# EAGLE design led balloon_v28 (EAGLE 6.0)
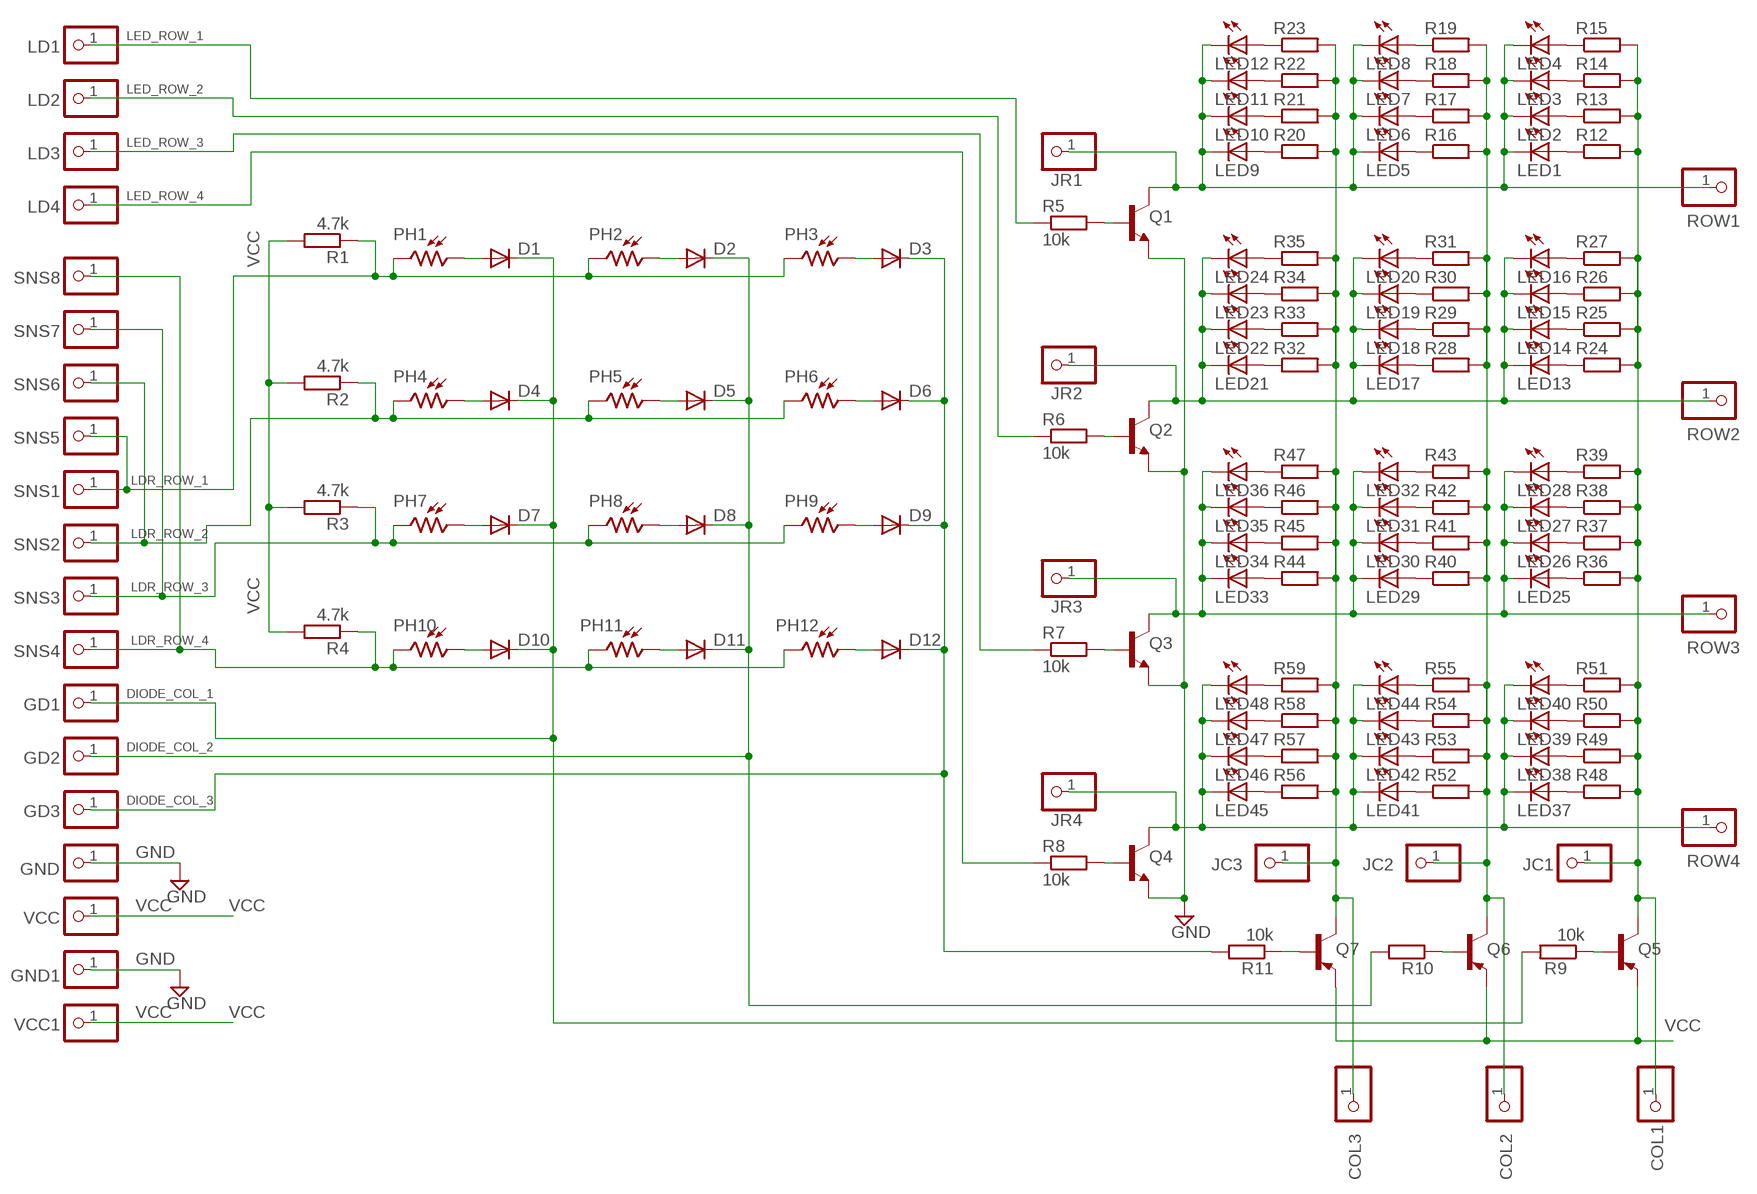
[diagram p0: schematic, sheet 1]

## Parts
COL1  PINHD-1X1  [1X01]
COL2  PINHD-1X1  [1X01]
COL3  PINHD-1X1  [1X01]
D1  1N4148DO35-7  [DO35-7]
D2  1N4148DO35-7  [DO35-7]
D3  1N4148DO35-7  [DO35-7]
D4  1N4148DO35-7  [DO35-7]
D5  1N4148DO35-7  [DO35-7]
D6  1N4148DO35-7  [DO35-7]
D7  1N4148DO35-7  [DO35-7]
D8  1N4148DO35-7  [DO35-7]
D9  1N4148DO35-7  [DO35-7]
D10  1N4148DO35-7  [DO35-7]
D11  1N4148DO35-7  [DO35-7]
D12  1N4148DO35-7  [DO35-7]
GD1  PINHD-1X1  [1X01]
GD2  PINHD-1X1  [1X01]
GD3  PINHD-1X1  [1X01]
GND  PINHD-1X1  [1X01]
GND1  PINHD-1X1  [1X01]
JC1  PINHD-1X1  [1X01]
JC2  PINHD-1X1  [1X01]
JC3  PINHD-1X1  [1X01]
JR1  PINHD-1X1  [1X01]
JR2  PINHD-1X1  [1X01]
JR3  PINHD-1X1  [1X01]
JR4  PINHD-1X1  [1X01]
LD1  PINHD-1X1  [1X01]
LD2  PINHD-1X1  [1X01]
LD3  PINHD-1X1  [1X01]
LD4  PINHD-1X1  [1X01]
LED1  LED3MM  [LED3MM]
LED2  LED3MM  [LED3MM]
LED3  LED3MM  [LED3MM]
LED4  LED3MM  [LED3MM]
LED5  LED3MM  [LED3MM]
LED6  LED3MM  [LED3MM]
LED7  LED3MM  [LED3MM]
LED8  LED3MM  [LED3MM]
LED9  LED3MM  [LED3MM]
LED10  LED3MM  [LED3MM]
LED11  LED3MM  [LED3MM]
LED12  LED3MM  [LED3MM]
LED13  LED3MM  [LED3MM]
LED14  LED3MM  [LED3MM]
LED15  LED3MM  [LED3MM]
LED16  LED3MM  [LED3MM]
LED17  LED3MM  [LED3MM]
LED18  LED3MM  [LED3MM]
LED19  LED3MM  [LED3MM]
LED20  LED3MM  [LED3MM]
LED21  LED3MM  [LED3MM]
LED22  LED3MM  [LED3MM]
LED23  LED3MM  [LED3MM]
LED24  LED3MM  [LED3MM]
LED25  LED3MM  [LED3MM]
LED26  LED3MM  [LED3MM]
LED27  LED3MM  [LED3MM]
LED28  LED3MM  [LED3MM]
LED29  LED3MM  [LED3MM]
LED30  LED3MM  [LED3MM]
LED31  LED3MM  [LED3MM]
LED32  LED3MM  [LED3MM]
LED33  LED3MM  [LED3MM]
LED34  LED3MM  [LED3MM]
LED35  LED3MM  [LED3MM]
LED36  LED3MM  [LED3MM]
LED37  LED3MM  [LED3MM]
LED38  LED3MM  [LED3MM]
LED39  LED3MM  [LED3MM]
LED40  LED3MM  [LED3MM]
LED41  LED3MM  [LED3MM]
LED42  LED3MM  [LED3MM]
LED43  LED3MM  [LED3MM]
LED44  LED3MM  [LED3MM]
LED45  LED3MM  [LED3MM]
LED46  LED3MM  [LED3MM]
LED47  LED3MM  [LED3MM]
LED48  LED3MM  [LED3MM]
PH1  LDR  [VT900]
PH2  VT83N4  [VT800]
PH3  VT83N4  [VT800]
PH4  VT83N4  [VT800]
PH5  VT83N4  [VT800]
PH6  VT83N4  [VT800]
PH7  VT83N4  [VT800]
PH8  VT83N4  [VT800]
PH9  VT83N4  [VT800]
PH10  VT83N4  [VT800]
PH11  VT83N4  [VT800]
PH12  VT83N4  [VT800]
Q1  BC847ASMD  [SOT23]
Q2  BC847ASMD  [SOT23]
Q3  BC847ASMD  [SOT23]
Q4  BC847ASMD  [SOT23]
Q5  BC807-40SMD  [SOT23-BEC]
Q6  BC807-40SMD  [SOT23-BEC]
Q7  BC807-40SMD  [SOT23-BEC]
R1  4.7k  R-EU_0204/5  [0204/5]
R2  4.7k  R-EU_0204/5  [0204/5]
R3  4.7k  R-EU_0204/5  [0204/5]
R4  4.7k  R-EU_0204/5  [0204/5]
R5  10k  R-EU_0204/5  [0204/5]
R6  10k  R-EU_0204/5  [0204/5]
R7  10k  R-EU_0204/5  [0204/5]
R8  10k  R-EU_0204/5  [0204/5]
R9  10k  R-EU_0204/5  [0204/5]
R10  10k  R-EU_0204/5  [0204/5]
R11  10k  R-EU_0204/5  [0204/5]
R12  R-EU_R0805  [R0805]
R13  R-EU_R0805  [R0805]
R14  R-EU_R0805  [R0805]
R15  R-EU_R0805  [R0805]
R16  R-EU_R0805  [R0805]
R17  R-EU_R0805  [R0805]
R18  R-EU_R0805  [R0805]
R19  R-EU_R0805  [R0805]
R20  R-EU_R0805  [R0805]
R21  R-EU_R0805  [R0805]
R22  R-EU_R0805  [R0805]
R23  R-EU_R0805  [R0805]
R24  R-EU_R0805  [R0805]
R25  R-EU_R0805  [R0805]
R26  R-EU_R0805  [R0805]
R27  R-EU_R0805  [R0805]
R28  R-EU_R0805  [R0805]
R29  R-EU_R0805  [R0805]
R30  R-EU_R0805  [R0805]
R31  R-EU_R0805  [R0805]
R32  R-EU_R0805  [R0805]
R33  R-EU_R0805  [R0805]
R34  R-EU_R0805  [R0805]
R35  R-EU_R0805  [R0805]
R36  R-EU_R0805  [R0805]
R37  R-EU_R0805  [R0805]
R38  R-EU_R0805  [R0805]
R39  R-EU_R0805  [R0805]
R40  R-EU_R0805  [R0805]
R41  R-EU_R0805  [R0805]
R42  R-EU_R0805  [R0805]
R43  R-EU_R0805  [R0805]
R44  R-EU_R0805  [R0805]
R45  R-EU_R0805  [R0805]
R46  R-EU_R0805  [R0805]
R47  R-EU_R0805  [R0805]
R48  R-EU_R0805  [R0805]
R49  R-EU_R0805  [R0805]
R50  R-EU_R0805  [R0805]
R51  R-EU_R0805  [R0805]
R52  R-EU_R0805  [R0805]
R53  R-EU_R0805  [R0805]
R54  R-EU_R0805  [R0805]
R55  R-EU_R0805  [R0805]
R56  R-EU_R0805  [R0805]
R57  R-EU_R0805  [R0805]
R58  R-EU_R0805  [R0805]
R59  R-EU_R0805  [R0805]
ROW1  PINHD-1X1  [1X01]
ROW2  PINHD-1X1  [1X01]
ROW3  PINHD-1X1  [1X01]
ROW4  PINHD-1X1  [1X01]
SNS1  PINHD-1X1  [1X01]
SNS2  PINHD-1X1  [1X01]
SNS3  PINHD-1X1  [1X01]
SNS4  PINHD-1X1  [1X01]
SNS5  PINHD-1X1  [1X01]
SNS6  PINHD-1X1  [1X01]
SNS7  PINHD-1X1  [1X01]
SNS8  PINHD-1X1  [1X01]
VCC  PINHD-1X1  [1X01]
VCC1  PINHD-1X1  [1X01]

## Nets
DIODE_COL_1: D1.C D4.C D7.C D10.C GD1.1 R9.2
DIODE_COL_2: D2.C D5.C D8.C D11.C GD2.1 R10.2
DIODE_COL_3: D3.C D6.C D9.C D12.C GD3.1 R11.2
GND [pwr]: GND1.1 GND.1 Q1.2(E) Q2.2(E) Q3.2(E) Q4.2(E)
LDR_ROW_1: PH1.2 PH2.2 PH3.2 R1.1 SNS1.1 SNS5.1
LDR_ROW_2: PH4.2 PH5.2 PH6.2 R2.1 SNS2.1 SNS6.1
LDR_ROW_3: PH7.2 PH8.2 PH9.2 R3.1 SNS3.1 SNS7.1
LDR_ROW_4: PH10.2 PH11.2 PH12.2 R4.1 SNS4.1 SNS8.1
LED_ROW_1: LD1.1 R5.1
LED_ROW_2: LD2.1 R6.1
LED_ROW_3: LD3.1 R7.1
LED_ROW_4: LD4.1 R8.1
N$1: D1.A PH1.1
N$2: D2.A PH2.1
N$3: D3.A PH3.1
N$4: D6.A PH6.1
N$5: D5.A PH5.1
N$6: D4.A PH4.1
N$7: D7.A PH7.1
N$8: D8.A PH8.1
N$9: D9.A PH9.1
N$10: D12.A PH12.1
N$11: D11.A PH11.1
N$12: D10.A PH10.1
N$13: Q6.B R10.1
N$14: Q7.B R11.1
N$15: Q5.B R9.1
N$16: JR1.1 LED1.K(C) LED2.K(C) LED3.K(C) LED4.K(C) LED5.K(C) LED6.K(C) LED7.K(C) LED8.K(C) LED9.K(C) LED10.K(C) LED11.K(C) LED12.K(C) Q1.3(C) ROW1.1
N$17: LED1.A R12.1
N$18: LED2.A R13.1
N$19: LED3.A R14.1
N$20: LED4.A R15.1
N$21: Q1.1(B) R5.2
N$22: JR3.1 LED25.K(C) LED26.K(C) LED27.K(C) LED28.K(C) LED29.K(C) LED30.K(C) LED31.K(C) LED32.K(C) LED33.K(C) LED34.K(C) LED35.K(C) LED36.K(C) Q3.3(C) ROW3.1
N$24: LED9.A R20.1
N$25: LED10.A R21.1
N$26: LED11.A R22.1
N$27: COL2.1 JC2.1 Q6.C R16.2 R17.2 R18.2 R19.2 R28.2 R29.2 R30.2 R31.2 R40.2 R41.2 R42.2 R43.2 R52.2 R53.2 R54.2 R55.2
N$28: LED13.A R24.1
N$29: Q2.1(B) R6.2
N$30: LED5.A R16.1
N$31: LED6.A R17.1
N$32: LED7.A R18.1
N$33: LED8.A R19.1
N$34: LED14.A R25.1
N$35: Q3.1(B) R7.2
N$37: LED12.A R23.1
N$38: LED15.A R26.1
N$39: LED16.A R27.1
N$41: LED17.A R28.1
N$42: Q4.1(B) R8.2
N$43: LED18.A R29.1
N$44: LED19.A R30.1
N$45: LED20.A R31.1
N$47: COL1.1 JC1.1 Q5.C R12.2 R13.2 R14.2 R15.2 R24.2 R25.2 R26.2 R27.2 R36.2 R37.2 R38.2 R39.2 R48.2 R49.2 R50.2 R51.2
N$48: LED21.A R32.1
N$49: LED22.A R33.1
N$50: LED23.A R34.1
N$51: LED24.A R35.1
N$52: COL3.1 JC3.1 Q7.C R20.2 R21.2 R22.2 R23.2 R32.2 R33.2 R34.2 R35.2 R44.2 R45.2 R46.2 R47.2 R56.2 R57.2 R58.2 R59.2
N$53: LED25.A R36.1
N$54: LED26.A R37.1
N$55: LED27.A R38.1
N$56: LED28.A R39.1
N$58: LED29.A R40.1
N$59: LED30.A R41.1
N$60: LED31.A R42.1
N$61: LED32.A R43.1
N$64: LED33.A R44.1
N$65: LED34.A R45.1
N$66: LED35.A R46.1
N$67: LED36.A R47.1
N$69: LED37.A R48.1
N$70: LED38.A R49.1
N$71: LED39.A R50.1
N$72: LED40.A R51.1
N$74: LED41.A R52.1
N$75: LED42.A R53.1
N$76: LED43.A R54.1
N$77: LED44.A R55.1
N$79: JR2.1 LED13.K(C) LED14.K(C) LED15.K(C) LED16.K(C) LED17.K(C) LED18.K(C) LED19.K(C) LED20.K(C) LED21.K(C) LED22.K(C) LED23.K(C) LED24.K(C) Q2.3(C) ROW2.1
N$80: LED45.A R56.1
N$81: LED46.A R57.1
N$82: LED47.A R58.1
N$83: LED48.A R59.1
N$93: JR4.1 LED37.K(C) LED38.K(C) LED39.K(C) LED40.K(C) LED41.K(C) LED42.K(C) LED43.K(C) LED44.K(C) LED45.K(C) LED46.K(C) LED47.K(C) LED48.K(C) Q4.3(C) ROW4.1
VCC [pwr]: Q5.E Q6.E Q7.E R1.2 R2.2 R3.2 R4.2 VCC1.1 VCC.1

## Library data of the parts
COL1-COL3 GD1-GD3 GND GND1 JC1-JC3 JR1-JR4 LD1-LD4 ROW1-ROW4 SNS1-SNS8 VCC VCC1 = pinhead:PINHD-1X1: PIN HEADER
D1-D12 = diode:1N4148: DIODE high speed (Philips)
LED1-LED48 = CEDTv66:LED
PH1 = ldr_3_5:LDR
PH2-PH12 = ldr_3_5:VT8: Photoconductive Cell VT800 Series Source: http://optoelectronics.perkinelmer.com/content/Datasheets/DTS_vt800seriesdatasheet.pdf
Q1-Q4 = transistor-npn:BC847*: NPN Transistor
Q5-Q7 = transistor-pnp:BC807*: PNP Transistror
R1-R11 = resistor:R-EU_: RESISTOR, European symbol
R12-R59 = rcl:R-EU_: RESISTOR, European symbol

## Net classes
0 default: width 0.406 mm
1 pwr: width 0.508 mm

## Board
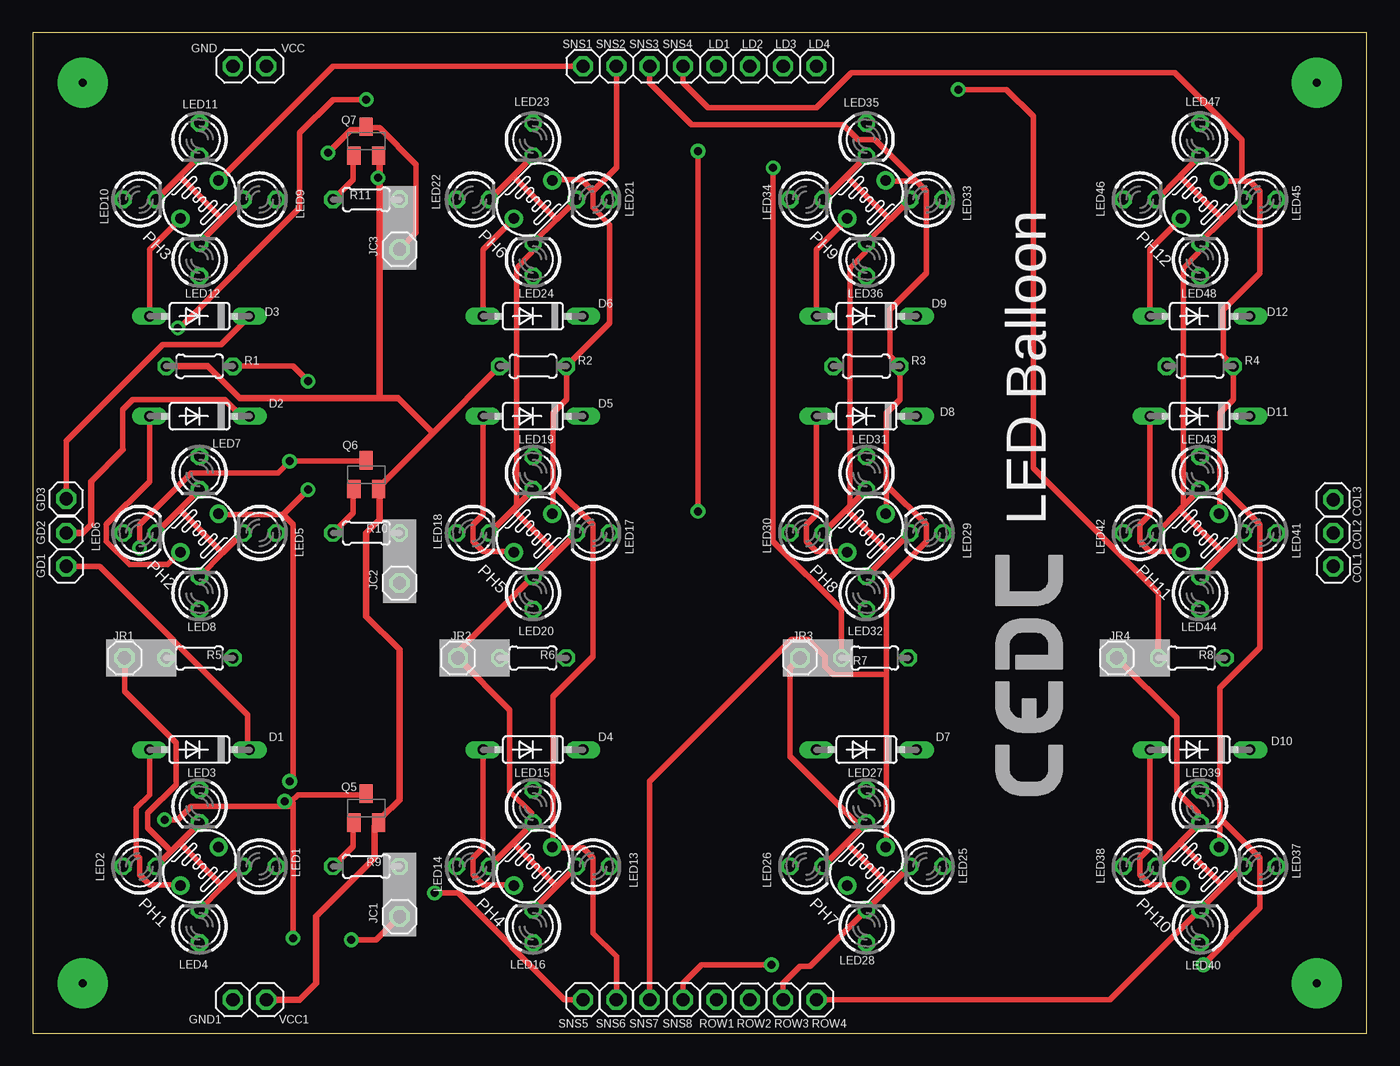
[diagram p1: board, top side]
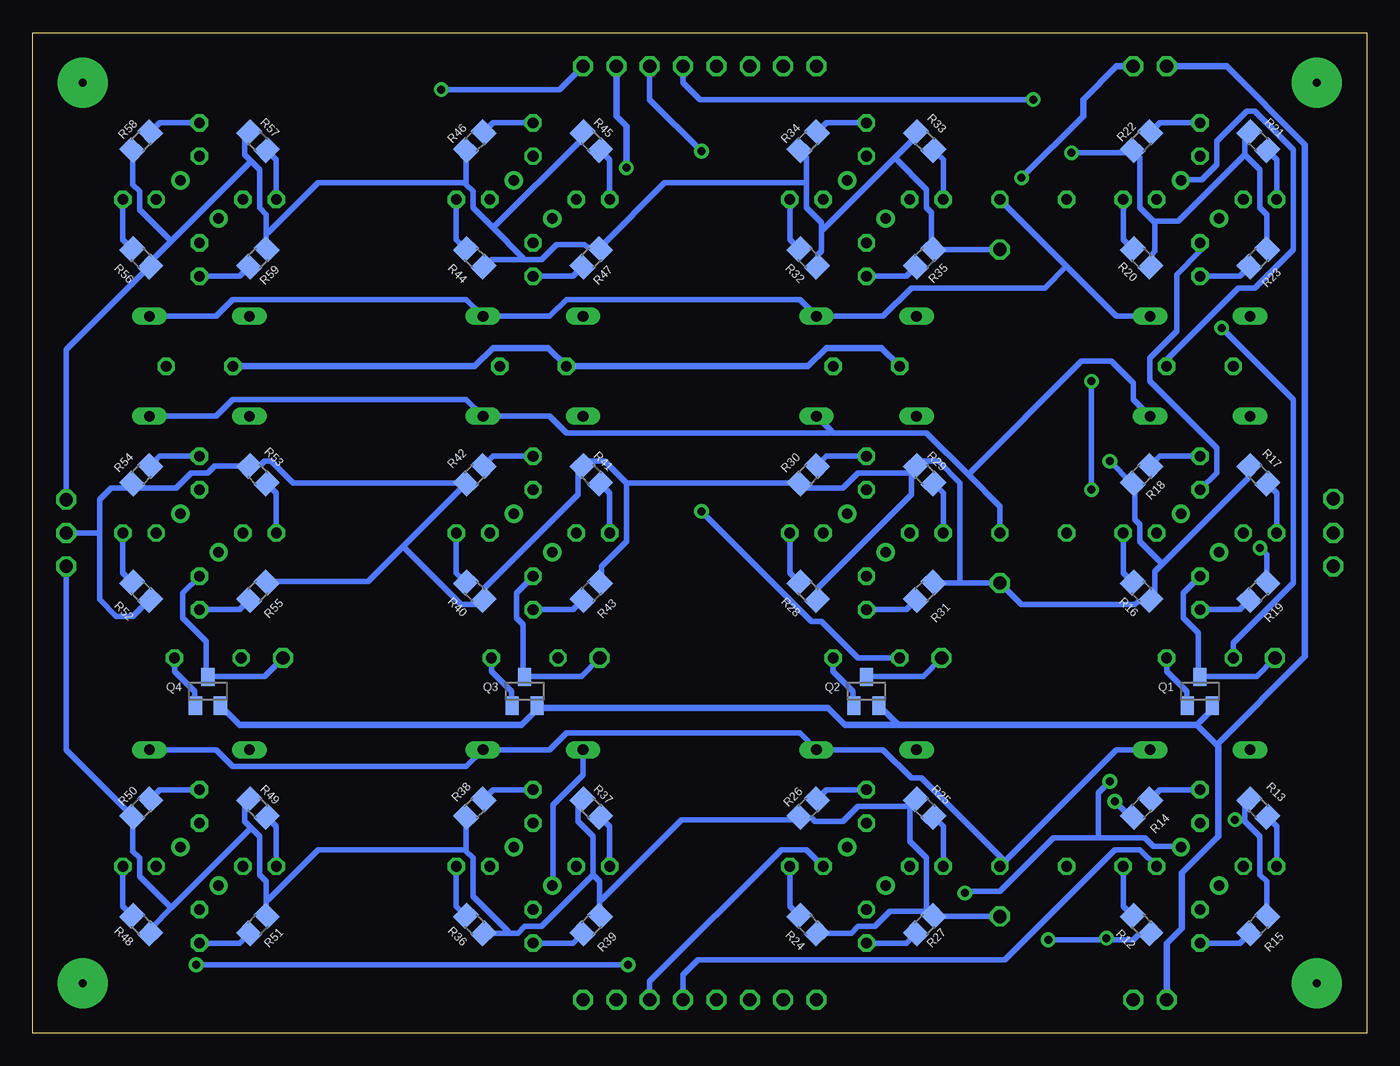
[diagram p2: board, bottom side, seen from below]

Size 101.6 x 76.2 mm. Coordinates in mm from the lower left corner, seen from the top.
Outline: 0,0 101.6,0 101.6,76.2 0,76.2 0,0
Copper layers (1*16): Top 0.035mm / dielectric 1.5mm / Bottom 0.035mm
Design rules "default": minimum track width 16mil, minimum drill 24mil, track to track 16mil, track to pad 16mil, pad to pad 16mil, via to via 16mil, smd to smd 16mil, copper to edge 40mil, drill to drill 10mil, minimum pad ring 10mil, minimum via ring 10mil, stop-mask expansion 4mil, vias tented up to drill 0mil, thermal gap 10mil

### Footprints (pad centres in the part's own frame; a part is rotated, then mirrored left to right if it is on the bottom)
1X01 = drill 1.016 octagon: 1 0,0
DO35-7 = drill 0.813 long: A 3.81,0; C -3.81,0
LED3MM = drill 0.813 octagon: A -1.27,0; K 1.27,0
VT900 = drill 0.8 pad 1.4: 1 -2.057,0; 2 2.057,0
SOT23 = smd 1 x 1.4: 1 -0.95,-1.1; 2 0.95,-1.1; 3 0,1.1
SOT23-BEC = smd 1 x 1.4: B -0.95,-1.1; C 0,1.1; E 0.95,-1.1
0204/5 = drill 0.813 octagon: 1 -2.54,0; 2 2.54,0
R0805 = smd 1.3 x 1.5: 1 -0.95,0; 2 0.95,0

### Placement (x,y rotation side)
COL1  99.06,35.56 0 top
COL2  99.06,38.1 180 top
COL3  99.06,40.64 180 top
D1  12.7,21.59 180 top
D2  12.7,46.99 180 top
D3  12.7,54.61 180 top
D4  38.1,21.59 180 top
D5  38.1,46.99 180 top
D6  38.1,54.61 180 top
D7  63.5,21.59 180 top
D8  63.5,46.99 180 top
D9  63.5,54.61 180 top
D10  88.9,21.59 180 top
D11  88.9,46.99 180 top
D12  88.9,54.61 180 top
E$1  [LOGO-CEDT-SILK-18MM]  78.42,18.1 90 top
GD1  2.54,35.56 270 top
GD2  2.54,38.1 180 top
GD3  2.54,40.7 180 top
GND  15.24,73.66 0 top
GND1  15.24,2.54 270 top
JC1  27.94,8.89 90 top
JC2  27.94,34.29 90 top
JC3  27.94,59.69 270 top
JR1  6.99,28.57 0 top
JR2  32.38,28.57 0 top
JR3  58.42,28.57 0 top
JR4  82.55,28.57 0 top
LD1  52.07,73.66 0 top
LD2  54.61,73.66 0 top
LD3  57.15,73.66 0 top
LD4  59.69,73.66 0 top
LED1  17.27,12.7 180 top
LED2  8.13,12.7 0 top
LED3  12.7,17.27 270 top
LED4  12.7,8.13 90 top
LED5  17.27,38.1 180 top
LED6  8.13,38.1 0 top
LED7  12.7,42.67 270 top
LED8  12.7,33.53 90 top
LED9  17.27,63.5 180 top
LED10  8.13,63.5 0 top
LED11  12.7,68.07 270 top
LED12  12.7,58.93 90 top
LED13  42.67,12.7 180 top
LED14  33.53,12.7 0 top
LED15  38.1,17.27 270 top
LED16  38.1,8.13 90 top
LED17  42.67,38.1 180 top
LED18  33.53,38.1 0 top
LED19  38.1,42.67 270 top
LED20  38.1,33.53 90 top
LED21  42.67,63.5 180 top
LED22  33.53,63.5 0 top
LED23  38.1,68.07 270 top
LED24  38.1,58.93 90 top
LED25  68.07,12.7 180 top
LED26  58.93,12.7 0 top
LED27  63.5,17.27 270 top
LED28  63.5,8.13 90 top
LED29  68.07,38.1 180 top
LED30  58.93,38.1 0 top
LED31  63.5,42.67 270 top
LED32  63.5,33.53 90 top
LED33  68.07,63.5 180 top
LED34  58.93,63.5 0 top
LED35  63.5,68.07 270 top
LED36  63.5,58.93 90 top
LED37  93.47,12.7 180 top
LED38  84.33,12.7 0 top
LED39  88.9,17.27 270 top
LED40  88.9,8.13 90 top
LED41  93.47,38.1 180 top
LED42  84.33,38.1 0 top
LED43  88.9,42.67 270 top
LED44  88.9,33.53 90 top
LED45  93.47,63.5 180 top
LED46  84.33,63.5 0 top
LED47  88.9,68.07 270 top
LED48  88.9,58.93 90 top
PH1  12.7,12.7 45 top
PH2  VT83N4  [VT900]  12.7,38.1 45 top
PH3  VT83N4  [VT900]  12.7,63.5 45 top
PH4  VT83N4  [VT900]  38.1,12.7 45 top
PH5  VT83N4  [VT900]  38.1,38.1 45 top
PH6  VT83N4  [VT900]  38.1,63.5 45 top
PH7  VT83N4  [VT900]  63.5,12.7 45 top
PH8  VT83N4  [VT900]  63.5,38.1 45 top
PH9  VT83N4  [VT900]  63.5,63.5 45 top
PH10  VT83N4  [VT900]  88.9,12.7 45 top
PH11  VT83N4  [VT900]  88.9,38.1 45 top
PH12  VT83N4  [VT900]  88.9,63.5 45 top
Q1  12.7,26.04 0 bottom
Q2  38.1,26.04 0 bottom
Q3  64.14,26.04 0 bottom
Q4  88.27,26.04 0 bottom
Q5  25.4,17.14 0 top
Q6  25.4,42.55 0 top
Q7  25.4,67.94 0 top
R1  12.7,50.8 180 top
R2  38.1,50.8 180 top
R3  63.5,50.8 180 top
R4  88.9,50.8 180 top
R5  12.7,28.57 0 top
R6  38.1,28.57 0 top
R7  64.14,28.57 0 top
R8  88.27,28.57 0 top
R9  25.4,12.7 0 top
R10  25.4,38.1 0 top
R11  25.4,63.5 0 top
R12  17.14,8.26 315 bottom
R13  8.26,17.14 135 bottom
R14  17.14,17.14 225 bottom
R15  8.26,8.26 45 bottom
R16  17.14,33.66 315 bottom
R17  8.26,42.55 135 bottom
R18  17.14,42.55 225 bottom
R19  8.26,33.66 45 bottom
R20  17.14,59.05 315 bottom
R21  8.26,67.94 135 bottom
R22  17.14,67.94 225 bottom
R23  8.26,59.05 45 bottom
R24  42.55,8.26 315 bottom
R25  33.66,17.14 135 bottom
R26  42.55,17.14 225 bottom
R27  33.66,8.26 45 bottom
R28  42.55,33.66 315 bottom
R29  33.66,42.55 135 bottom
R30  42.55,42.55 225 bottom
R31  33.66,33.66 45 bottom
R32  42.55,59.05 315 bottom
R33  33.66,67.94 135 bottom
R34  42.55,67.94 225 bottom
R35  33.66,59.05 45 bottom
R36  67.94,8.26 315 bottom
R37  59.05,17.14 135 bottom
R38  67.94,17.14 225 bottom
R39  59.05,8.26 45 bottom
R40  67.94,33.66 315 bottom
R41  59.05,42.55 135 bottom
R42  67.94,42.55 225 bottom
R43  59.05,33.66 45 bottom
R44  67.94,59.05 315 bottom
R45  59.05,67.94 135 bottom
R46  67.94,67.94 225 bottom
R47  59.05,59.05 45 bottom
R48  93.34,8.26 315 bottom
R49  84.45,17.14 135 bottom
R50  93.34,17.14 225 bottom
R51  84.45,8.26 45 bottom
R52  93.34,33.66 315 bottom
R53  84.45,42.55 135 bottom
R54  93.34,42.55 225 bottom
R55  84.45,33.66 45 bottom
R56  93.34,59.05 315 bottom
R57  84.45,67.94 135 bottom
R58  93.34,67.94 225 bottom
R59  84.45,59.05 45 bottom
ROW1  52.07,2.54 90 top
ROW2  54.61,2.54 90 top
ROW3  57.15,2.54 90 top
ROW4  59.69,2.54 90 top
SNS1  41.91,73.66 0 top
SNS2  44.45,73.66 0 top
SNS3  46.99,73.66 0 top
SNS4  49.53,73.66 0 top
SNS5  41.91,2.54 270 top
SNS6  44.45,2.54 270 top
SNS7  46.99,2.54 270 top
SNS8  49.53,2.54 270 top
VCC  17.78,73.66 0 top
VCC1  17.78,2.54 270 top

### Tracks (layer width: path | path; a pad name or v marks a point on that pad's centre or on a via)
DIODE_COL_1
  Top 0.406: GD1.1 5.08,35.56 16.38,24.26 16.38,21.72 D1.C
  Bottom 0.406: D1.C 19.05,21.59 R9.2 27.69,13.21 33.91,19.43 34.67,19.43 36.83,21.59 D4.C 43.18,22.86 60.96,22.86 62.23,21.59 D7.C 68.58,20.32 86.36,20.32 87.63,21.59 D10.C
DIODE_COL_2
  Top 0.406: 6.86,44.45 6.86,47.5 7.62,48.26 14.61,48.26 15.88,46.99 D2.C
  Top 0.508: 6.86,44.45 4.45,42.04 4.45,38.73 3.81,38.1 GD2.1
  Bottom 0.406: R10.2 27.94,40.13 30.35,42.55 | 30.35,42.55 33.53,45.72 40.64,45.72 40.77,45.85 | D5.C 40.77,45.85 | 30.35,42.55 21.72,51.18 19.43,51.18 17.78,49.53 17.78,48.26 D2.C | 40.77,45.85 40.89,45.72 60.96,45.72 62.23,46.99 D8.C 68.58,48.26 86.36,48.26 87.63,46.99 D11.C
DIODE_COL_3
  Top 0.406: GD3.1 2.54,45.09 9.91,52.45 14.35,52.45 D3.C
  Bottom 0.406: D3.C 19.05,54.61 22.86,58.42 | R11.2 22.86,58.42 | D12.C 87.63,54.61 86.36,55.88 68.58,55.88 D9.C 62.23,54.61 60.96,55.88 43.18,55.88 D6.C 36.83,54.61 34.67,56.77 24.51,56.77 22.86,58.42
GND
  Bottom 0.508: Q4.2 87.25,24.89 85.85,23.5 64.39,23.5 63.25,24.64 63.25,24.89 Q3.2 62.99,24.77 41.02,24.77 39.75,23.5 35.94,23.5 35.81,23.62 | 12.95,23.5 11.81,24.64 11.81,24.89 Q1.2 | 12.95,23.5 35.69,23.5 35.81,23.62 | 35.81,23.62 37.08,24.89 Q2.2 | GND1.1 15.24,6.86 14.1,8 14.1,12.19 11.3,14.99 11.3,21.84 11.43,21.97 | 12.95,23.5 11.43,21.97 | GND.1 10.67,73.66 4.7,67.69 4.7,28.7 11.43,21.97
LDR_ROW_1  (via drill 0.61)
  Top 0.406: SNS1.1 22.86,73.66 PH3.2 | v30.61,10.67 32.38,10.67 40.51,2.54 SNS5.1 | 19.05,39.5 14.22,39.5 PH2.2 | 19.05,39.5 19.81,38.73 19.81,19.43 v19.56,19.18 | R1.1 19.81,50.8 v20.95,49.66 | 19.05,39.5 v20.95,41.4
  Bottom 0.406: R1.1 15.24,51.31 9.78,56.77 8.51,56.77 5.59,59.69 5.59,67.31 8.51,70.23 9.14,70.23 11.43,67.94 11.43,66.17 12.57,65.02 14.1,65.02 PH3.2 | 20.45,14.86 23.88,14.86 27.94,10.79 30.48,10.79 v30.61,10.67 | 20.45,14.86 16.89,14.86 16.26,14.22 14.22,14.22 PH1.2 | v19.56,19.18 20.45,18.29 20.45,14.86 | v20.95,41.4 v20.95,49.66
LDR_ROW_2
  Top 0.406: 39.62,41.66 39.62,39.62 PH5.2 | 39.62,41.66 39.62,47.24 40.64,48.26 R2.1 43.94,54.1 43.94,61.59 42.67,62.87 42.67,64.14 | PH6.2 39.62,65.02 41.78,65.02 42.67,64.14 | 39.62,41.66 39.75,41.66 42.67,38.73 42.67,28.7 39.62,25.65 39.62,14.35 PH4.2 39.62,14.1 41.91,14.1 42.67,13.34 42.67,7.62 44.45,5.84 SNS6.1 | SNS2.1 44.45,65.91 42.67,64.14
LDR_ROW_3
  Top 0.406: 65.02,41.66 65.02,39.62 PH8.2 | 65.02,41.66 65.02,47.24 66.04,48.26 R3.1 65.28,51.56 65.28,55.12 68.07,57.91 68.07,64.14 67.31,64.9 67.18,64.9 | 65.02,27.3 65.02,34.42 68.07,37.47 68.07,38.73 65.15,41.66 65.02,41.66 | 65.02,27.3 65.02,14.22 PH7.2 | 67.18,64.9 65.02,64.9 PH9.2 | SNS7.1 46.99,19.18 57.78,29.97 59.05,29.97 60.33,28.7 60.33,27.94 60.96,27.3 65.02,27.3 | 67.18,64.9 67.18,65.02 64.14,68.07 62.87,68.07 61.72,69.22 50.16,69.22 46.99,72.39 SNS3.1
LDR_ROW_4  (via drill 0.61)
  Top 0.406: 90.42,41.66 90.42,39.62 PH11.2 | 90.42,41.66 90.42,47.24 91.44,48.26 R4.1 90.68,51.56 90.68,55.12 93.47,57.91 93.47,64.14 92.71,64.9 92.08,64.9 | 90.42,16.26 90.42,26.29 93.47,29.34 93.47,38.73 90.55,41.66 90.42,41.66 | 90.42,16.26 90.42,14.22 PH10.2 | 92.08,64.9 90.42,64.9 PH12.2 | v56.26,5.21 50.93,5.21 49.53,3.81 SNS8.1 | v89.15,5.21 93.47,9.53 93.47,13.34 90.55,16.26 90.42,16.26 | 92.08,64.9 92.08,68.07 87,73.15 62.36,73.15 59.69,70.48 51.44,70.48 49.53,72.39 SNS4.1
  Bottom 0.406: v89.15,5.21 v56.26,5.21
LED_ROW_1  (via drill 0.61)
  Top 0.406: v11.05,53.72 11.18,53.72 20.32,62.87 20.32,68.58 22.86,71.12 v25.4,71.12
  Bottom 0.406: R5.1 10.16,29.72 5.59,34.29 5.59,48.26 v11.05,53.72 | LD1.1 52.07,72.39 50.8,71.12 v25.4,71.12
LED_ROW_2  (via drill 0.61)
  Top 0.406: v50.67,67.18 v50.67,39.75
  Bottom 0.406: R6.1 38.73,28.57 41.53,31.37 42.29,31.37 v50.67,39.75 | v50.67,67.18 54.61,71.12 LD2.1
LED_ROW_3  (via drill 0.61)
  Top 0.406: R7.1 61.59,32.26 56.39,37.47 v56.39,65.91
  Bottom 0.508: v56.39,65.91 56.39,69.09 57.15,69.85 LD3.1
LED_ROW_4  (via drill 0.61)
  Top 0.406: R8.1 85.72,33.53 76.2,43.05 76.2,69.85 74.17,71.88 v70.48,71.88
  Bottom 0.406: v70.48,71.88 61.47,71.88 LD4.1
N$1
  Top 0.406: D1.A 8.89,18.16 7.87,17.14 7.87,13.59 8.13,13.34 8.13,12.06 8.89,11.3 11.18,11.3 PH1.1
N$2
  Top 0.406: D2.A 8.89,42.04 5.59,38.73 5.59,37.47 7.37,35.69 10.29,35.69 PH2.1
N$3
  Top 0.406: D3.A 8.89,59.69 PH3.1
N$4
  Top 0.406: D6.A 34.29,59.69 PH6.1
N$5
  Top 0.406: D5.A 34.29,39.5 33.53,38.73 33.53,37.47 34.29,36.7 36.58,36.7 PH5.1
N$6
  Top 0.406: D4.A 34.29,14.1 33.53,13.34 33.53,12.06 34.29,11.3 36.58,11.3 PH4.1
N$7
  Bottom 0.406: D7.A 59.69,19.68 61.98,17.4 61.98,11.3 PH7.1
N$8
  Top 0.406: D8.A 59.69,39.5 58.93,38.73 58.93,37.47 59.69,36.7 61.98,36.7 PH8.1
N$9
  Top 0.406: D9.A 59.69,59.69 PH9.1
N$10
  Top 0.406: D12.A 85.09,59.69 PH12.1
N$11
  Top 0.406: D11.A 85.09,39.5 84.33,38.73 84.33,37.47 85.09,36.7 87.38,36.7 PH11.1
N$12
  Top 0.406: D10.A 85.09,14.1 84.33,13.34 84.33,12.06 85.09,11.3 87.38,11.3 PH10.1
N$13
  Top 0.406: R10.1 24.38,39.62 24.38,41.4 Q6.B
N$14
  Top 0.406: R11.1 24.38,65.02 24.38,66.8 Q7.B
N$15
  Top 0.406: R9.1 24.38,14.22 24.38,16 Q5.B
N$16
  Top 0.406: LED11.K 11.18,65.28 | 11.18,65.28 LED10.K | LED9.K 14.48,61.98 | 14.48,61.98 LED12.K | 14.48,61.98 11.18,65.28 | LED7.K 11.18,39.88 | 11.18,39.88 LED6.K | LED5.K 14.48,36.58 | 14.48,36.58 LED8.K | 14.48,36.58 11.18,39.88 | LED3.K 11.18,14.48 | 11.18,14.48 10.54,13.84 | 10.54,13.84 LED2.K | LED1.K 14.48,11.18 | 14.48,11.18 LED4.K | 14.48,11.18 11.18,14.48 | JR1.1 6.99,26.04 10.92,22.1 10.92,18.92 8.76,16.76 8.76,15.62 10.54,13.84
  Bottom 0.406: JR1.1 8.38,27.18 12.7,27.18 Q1.3 12.83,27.3 12.83,30.48 13.97,31.62 13.97,33.53 LED8.K | LED12.K 12.7,59.56 14.48,57.78 14.48,53.47 16.51,51.44 16.51,49.66 11.43,44.58 11.43,42.67 LED7.K | LED1.K 17.27,13.97 19.18,13.97 27.56,5.59 50.93,5.59 52.07,4.45 ROW1.1
N$17
  Bottom 0.406: LED1.A 18.54,9.65 17.84,8.95 | 17.84,8.95 R12.1 | R12.1 17.78,8.89 | R12.1 17.91,8.89 17.84,8.95
N$18
  Bottom 0.406: LED2.A 6.86,15.75 R13.1 7.62,16.51
N$19
  Bottom 0.406: LED3.A 15.75,18.54 R14.1 16.51,17.78
N$20
  Bottom 0.406: LED4.A 9.65,6.86 8.95,7.56 | 8.95,7.56 R15.1 | R15.1 8.89,7.62 | R15.1 9.02,7.62 8.95,7.56
N$21
  Bottom 0.406: R5.2 15.24,27.56 13.72,26.04 13.72,25.02 Q1.1
N$22
  Top 0.406: 61.98,14.48 LED27.K 62.99,15.75 57.66,21.08 57.66,27.81 JR3.1 | 61.98,14.48 LED26.K | LED25.K 65.28,11.18 | 65.28,11.18 LED28.K 59.18,5.08 58.42,5.08 57.15,3.81 ROW3.1 | 65.28,11.18 61.98,14.48 | LED35.K 61.98,65.28 | 61.98,65.28 LED34.K | LED33.K 65.28,61.98 | 65.28,61.98 LED36.K 63.37,60.07 63.37,59.44 62.23,58.29 62.23,40.39 62.36,40.26 | 65.28,61.98 61.98,65.28 | LED31.K 62.36,40.26 | 62.36,40.26 61.98,39.88 | 61.98,39.88 LED30.K | LED29.K 65.28,36.58 | 65.28,36.58 LED32.K | 65.28,36.58 61.98,39.88
  Bottom 0.406: JR3.1 59.82,27.18 64.14,27.18 Q3.3 64.26,27.3 64.26,31.11 64.77,31.62 64.77,33.53 LED32.K
N$24
  Bottom 0.406: LED9.A 18.54,60.45 R20.1
N$25
  Bottom 0.406: LED10.A 6.86,66.55 R21.1 7.62,67.31
N$26
  Bottom 0.406: LED11.A 15.75,69.34 R22.1
N$27  (via drill 0.61)
  Top 0.406: Q6.C 25.4,43.56 v19.56,43.56 18.67,42.67 12.06,42.67 8.13,38.73 v8.13,36.96
  Bottom 0.406: v19.56,43.56 17.91,41.91 R18.2 17.65,41.78 17.65,39.12 17.27,38.73 17.27,37.47 15.56,35.75 | v8.13,36.96 7.62,36.45 7.62,34.42 R19.2 | 30.99,34.29 JC2.1 26.29,32.64 17.65,32.64 17.4,32.89 16.51,32.89 R16.2 16.38,33.15 16.13,33.4 16.13,35.18 15.56,35.75 | 30.99,34.29 32.89,34.29 R31.2 | 15.56,35.75 9.02,42.29 9.02,43.18 R17.2 | 94.11,41.53 90.68,41.53 89.53,42.67 88.27,42.67 87.76,43.18 85.22,43.18 R53.2 84.96,43.31 84.2,43.31 83.95,43.56 83.44,43.56 81.79,41.91 68.83,41.91 | 94.11,41.53 R54.2 | 73.41,37.08 R42.2 68.83,41.91 | 73.41,37.08 76.07,34.42 83.69,34.42 R55.2 | R28.2 41.78,33.02 41.78,33.91 34.67,41.02 34.67,42.93 34.42,43.18 R29.2 | 56.39,41.91 56.39,37.47 58.29,35.56 58.29,34.42 R43.2 | 56.39,41.91 58.04,43.56 59.31,43.56 59.56,43.31 R41.2 59.82,43.18 60.07,42.93 60.07,41.02 67.18,33.91 67.18,33.02 R40.2 67.44,32.89 67.69,32.64 68.96,32.64 73.41,37.08 | 56.39,41.91 43.31,41.91 R30.2 43.05,41.78 42.8,41.53 39.88,41.53 38.73,42.67 34.8,42.67 R29.2 | 30.99,34.29 30.99,41.91 32.64,43.56 33.91,43.56 34.16,43.31 R29.2 | 94.11,41.53 95.63,41.53 96.52,40.64 96.52,38.1 | R52.2 92.75,32.98 93.98,31.75 95.25,31.75 96.52,33.02 96.52,38.1 | COL2.1 96.52,38.1 | 68.83,41.91 68.58,41.91
N$28
  Bottom 0.406: LED13.A 43.94,9.65 R24.1
N$29
  Bottom 0.406: R6.2 40.64,27.56 39.12,26.04 39.12,25.02 Q2.1
N$30
  Bottom 0.406: LED5.A 18.54,35.05 R16.1
N$31
  Bottom 0.406: LED6.A 6.86,41.15 R17.1 7.62,41.91
N$32
  Bottom 0.406: LED7.A 15.75,43.94 R18.1
N$33
  Bottom 0.406: LED8.A 9.65,32.26 R19.1
N$34
  Bottom 0.406: LED14.A 32.26,15.75 R25.1 33.02,16.51
N$35
  Bottom 0.406: R7.2 66.67,27.56 65.15,26.04 65.15,25.02 Q3.1
N$37
  Bottom 0.406: LED12.A 9.65,57.66 R23.1
N$38
  Bottom 0.406: LED15.A 41.15,18.54 R26.1
N$39
  Bottom 0.406: LED16.A 35.05,6.86 R27.1
N$41
  Bottom 0.406: LED17.A 43.94,35.05 R28.1
N$42
  Bottom 0.406: R8.2 90.81,27.56 89.28,26.04 89.28,25.02 Q4.1
N$43
  Bottom 0.406: LED18.A 32.26,41.15 R29.1
N$44
  Bottom 0.406: LED19.A 41.15,43.94 R30.1
N$45
  Bottom 0.406: 34.42,32.89 R31.1 35.05,32.26 LED20.A
N$47  (via drill 0.61)
  Top 0.406: 19.68,17.65 20.19,18.16 25.4,18.16 Q5.C | v19.18,17.65 19.68,17.65 | v24.26,7.11 26.16,7.11 JC1.1 | v19.81,7.24 19.81,17.27 | 19.81,17.27 19.81,17.53 19.68,17.65 | v10.03,16.26 11.05,16.26 12.06,17.27 19.81,17.27
  Bottom 0.406: 34.92,17.27 38.73,17.27 39.88,16.13 42.04,16.13 42.29,16.38 43.18,16.38 R26.2 43.31,16.26 52.2,16.26 58.29,10.16 58.42,10.16 | 34.92,17.27 34.42,17.78 R25.2 | 9.27,16.13 8.13,14.99 8.13,12.06 7.62,11.56 7.62,9.02 R15.2 | 9.27,16.13 9.27,17.53 9.02,17.78 R13.2 | v19.18,17.65 17.91,16.38 R14.2 | v24.26,7.11 19.81,7.11 | 19.81,7.11 17.78,7.11 17.4,7.49 16.51,7.49 R12.2 | JC1.1 32.89,8.89 R27.2 | R24.2 41.78,7.62 39.24,7.62 38.73,8.13 37.47,8.13 36.32,9.27 33.4,9.27 33.15,9.02 R27.2 | v19.81,7.24 19.81,7.11 | v10.03,16.26 9.4,16.26 9.27,16.13 | 34.92,17.27 34.8,17.14 34.8,14.61 33.53,13.34 33.53,9.4 R27.2 | 58.42,10.16 58.42,11.56 58.93,12.06 | 58.42,10.16 58.42,9.02 R39.2 | 58.93,12.06 58.93,14.99 60.07,16.13 60.07,17.53 59.82,17.78 R37.2 | 65.41,7.62 64.64,7.62 64.14,8.13 62.87,8.13 58.93,12.06 | 65.41,7.62 67.18,7.62 R36.2 | 68.58,13.97 68.58,13.84 68.07,13.34 68.07,10.41 65.41,7.75 65.41,7.62 | 68.58,13.97 68.58,16.38 R38.2 | 83.82,10.16 83.82,11.56 84.33,12.06 84.33,14.99 84.96,15.62 | 83.82,10.16 83.82,9.02 R51.2 | 84.96,15.62 85.47,16.13 85.47,17.53 85.22,17.78 R49.2 | 84.96,15.62 91.06,9.53 | 91.06,9.53 92.58,8 92.58,7.62 R48.2 | 91.06,9.53 93.47,11.94 93.47,13.34 93.98,13.84 93.98,16.38 R50.2 94.11,16.64 99.06,21.59 COL1.1 | 68.58,13.97 79.88,13.97 83.69,10.16 83.82,10.16
N$48
  Bottom 0.406: LED21.A 43.94,60.45 R32.1
N$49
  Bottom 0.406: LED22.A 32.26,66.55 R33.1
N$50
  Bottom 0.406: LED23.A 41.15,69.34 R34.1
N$51
  Bottom 0.406: LED24.A 35.05,57.66 R35.1
N$52  (via drill 0.61)
  Top 0.406: JC3.1 29.21,60.96 29.21,66.17 26.42,68.96 25.4,68.96 Q7.C 25.27,68.83 24.26,68.83 v22.48,67.06
  Bottom 0.406: 16.13,61.72 16.13,59.56 16.38,59.31 16.38,58.42 R20.2 | 16.13,61.72 17.27,62.87 17.27,66.67 17.78,67.18 R22.2 17.91,67.06 v22.48,67.06 | 9.27,66.93 8.13,65.79 8.13,62.87 7.62,62.36 7.62,59.82 R23.2 | 9.27,66.93 9.27,68.33 9.02,68.58 R21.2 | 9.27,66.93 14.35,61.85 16,61.85 16.13,61.72 | JC3.1 32.89,59.69 R35.2 33.15,59.82 33.15,62.48 33.53,62.87 33.53,64.26 35.94,66.67 | 41.53,61.21 41.53,61.72 42.67,62.87 42.67,64.77 | 41.53,61.21 41.53,59.56 41.78,59.31 41.78,58.42 R32.2 | 42.67,64.77 42.67,66.67 43.18,67.18 R34.2 | 35.94,66.67 41.4,61.21 41.53,61.21 | 35.94,66.67 34.42,68.2 34.42,68.58 R33.2 | 64.26,58.93 66.67,58.93 67.18,58.42 R44.2 | 64.26,58.93 62.87,58.93 61.72,60.07 59.56,60.07 59.31,59.82 58.42,59.82 R47.2 58.29,59.94 53.47,64.77 42.67,64.77 | 68.58,64.77 68.58,64.64 68.07,64.14 68.07,62.87 66.55,61.34 | 68.58,64.77 68.58,67.18 R46.2 | 66.55,61.34 64.26,59.05 64.26,58.93 | 66.55,61.34 59.82,68.07 59.82,68.58 R45.2 | 83.82,60.96 83.82,62.36 84.33,62.87 84.33,65.79 84.96,66.42 | 83.82,60.96 83.82,59.82 R59.2 | 84.96,66.42 85.47,66.93 85.47,68.33 85.22,68.58 R57.2 | 84.96,66.42 91.06,60.33 | 91.06,60.33 92.58,58.8 92.58,58.42 R56.2 92.84,58.29 99.06,52.07 COL3.1 | 91.06,60.33 93.47,62.74 93.47,64.14 93.98,64.64 93.98,67.18 R58.2 | 68.58,64.77 79.88,64.77 83.69,60.96 83.82,60.96
N$53
  Bottom 0.406: LED25.A 69.34,9.65 68.64,8.95 | 68.64,8.95 R36.1 | R36.1 68.58,8.89 | R36.1 68.71,8.89 68.64,8.95
N$54
  Bottom 0.406: LED26.A 57.66,15.75 R37.1
N$55
  Bottom 0.406: LED27.A 66.55,18.54 R38.1
N$56
  Bottom 0.406: LED28.A 60.45,6.86 R39.1
N$58
  Bottom 0.406: LED29.A 69.34,35.05 R40.1
N$59
  Bottom 0.406: LED30.A 57.66,41.15 R41.1
N$60
  Bottom 0.406: LED31.A 66.55,43.94 R42.1 67.31,43.18
N$61
  Bottom 0.406: LED32.A 60.45,32.26 R43.1
N$64
  Bottom 0.406: LED33.A 69.34,60.45 R44.1
N$65
  Bottom 0.406: LED34.A 57.66,66.55 R45.1
N$66
  Bottom 0.406: LED35.A 66.55,69.34 R46.1 67.31,68.58
N$67
  Bottom 0.406: LED36.A 60.45,57.66 R47.1
N$69
  Bottom 0.406: LED37.A 94.74,9.65 R48.1
N$70
  Bottom 0.406: LED38.A 83.06,15.75 R49.1
N$71
  Bottom 0.406: LED39.A 91.95,18.54 R50.1
N$72
  Bottom 0.406: LED40.A 85.85,6.86 85.15,7.56 | 85.15,7.56 R51.1 | R51.1 85.09,7.62 | R51.1 85.22,7.62 85.15,7.56
N$74
  Bottom 0.406: LED41.A 94.74,35.05 R52.1
N$75
  Bottom 0.406: LED42.A 83.06,41.15 R53.1
N$76
  Bottom 0.406: LED43.A 91.95,43.94 R54.1
N$77
  Bottom 0.406: LED44.A 85.85,32.26 R55.1
N$79
  Top 0.406: 36.58,14.48 LED15.K 37.97,16.13 37.97,16.76 36.32,18.41 36.32,24.64 JR2.1 32.38,29.08 LED20.K 39.88,36.58 | 36.58,14.48 LED14.K | LED13.K 39.88,11.18 | 39.88,11.18 LED16.K | 39.88,11.18 36.58,14.48 | LED23.K 36.58,65.28 | 36.58,65.28 LED22.K | LED21.K 39.88,61.98 | 39.88,61.98 LED24.K 37.97,60.07 37.97,59.44 36.83,58.29 36.83,40.39 36.96,40.26 | 39.88,61.98 36.58,65.28 | LED19.K 36.96,40.26 | 36.96,40.26 36.58,39.88 | 36.58,39.88 LED18.K | LED17.K 39.88,36.58 | 39.88,36.58 36.58,39.88
  Bottom 0.406: ROW2.1 54.61,3.94 44.58,13.97 42.67,13.97 LED13.K | JR2.1 33.78,27.18 38.1,27.18 Q2.3
N$80
  Bottom 0.406: LED45.A 94.74,60.45 R56.1
N$81
  Bottom 0.406: LED46.A 83.06,66.55 R57.1
N$82
  Bottom 0.406: LED47.A 91.95,69.34 R58.1
N$83
  Bottom 0.406: LED48.A 85.85,57.66 R59.1
N$93
  Top 0.406: 87.38,14.48 LED39.K 88.77,16.13 88.77,16.76 87.12,18.41 87.12,24 JR4.1 | 87.38,14.48 LED38.K | LED37.K 90.68,11.18 | 90.68,11.18 LED40.K 82.04,2.54 ROW4.1 | 90.68,11.18 87.38,14.48 | LED47.K 87.38,65.28 | 87.38,65.28 LED46.K | LED45.K 90.68,61.98 | 90.68,61.98 LED48.K 88.77,60.07 88.77,59.44 87.63,58.29 87.63,40.39 87.76,40.26 | 90.68,61.98 87.38,65.28 | LED43.K 87.76,40.26 | 87.76,40.26 87.38,39.88 | 87.38,39.88 LED42.K | LED41.K 90.68,36.58 | 90.68,36.58 LED44.K | 90.68,36.58 87.38,39.88
  Bottom 0.406: JR4.1 83.95,27.18 88.27,27.18 Q4.3 88.39,27.3 88.39,29.84 90.17,31.62 90.17,33.53 LED44.K
S$1  (via drill 0.61 pad 3.81)
  other vias: 3.81,72.39
S$2  (via drill 0.61 pad 3.81)
  other vias: 97.79,72.39
S$3  (via drill 0.61 pad 3.81)
  other vias: 97.79,3.81
S$4  (via drill 0.61 pad 3.81)
  other vias: 3.81,3.81
VCC  (via drill 0.61)
  Top 0.508: 26.29,16 Q5.E | 26.42,66.8 Q7.E 26.42,66.55 26.42,65.15 | R1.2 13.34,50.8 15.75,48.39 26.42,48.39 | 26.42,16.26 Q5.E | R2.2 30.48,45.72 | 30.48,45.72 26.42,41.66 26.42,41.53 Q6.E 26.42,41.27 26.42,39.12 25.4,38.1 25.4,31.75 27.94,29.21 27.94,17.78 26.54,16.38 Q5.E | 30.48,45.72 27.81,48.39 26.42,48.39 | VCC1.1 20.32,2.54 21.59,3.81 21.59,8.89 26.04,13.34 26.04,15.73 Q5.E | 26.42,48.39 26.42,65.15 | v26.29,65.15 26.42,65.15
  Bottom 0.508: R2.2 36.96,52.2 41.15,52.2 42.55,50.8 R3.2 62.36,52.2 66.55,52.2 67.94,50.8 R4.2 | v26.29,65.15 21.59,69.85 21.59,71.12 19.05,73.66 VCC.1

### Text on the board
tPlace: LED Balloon